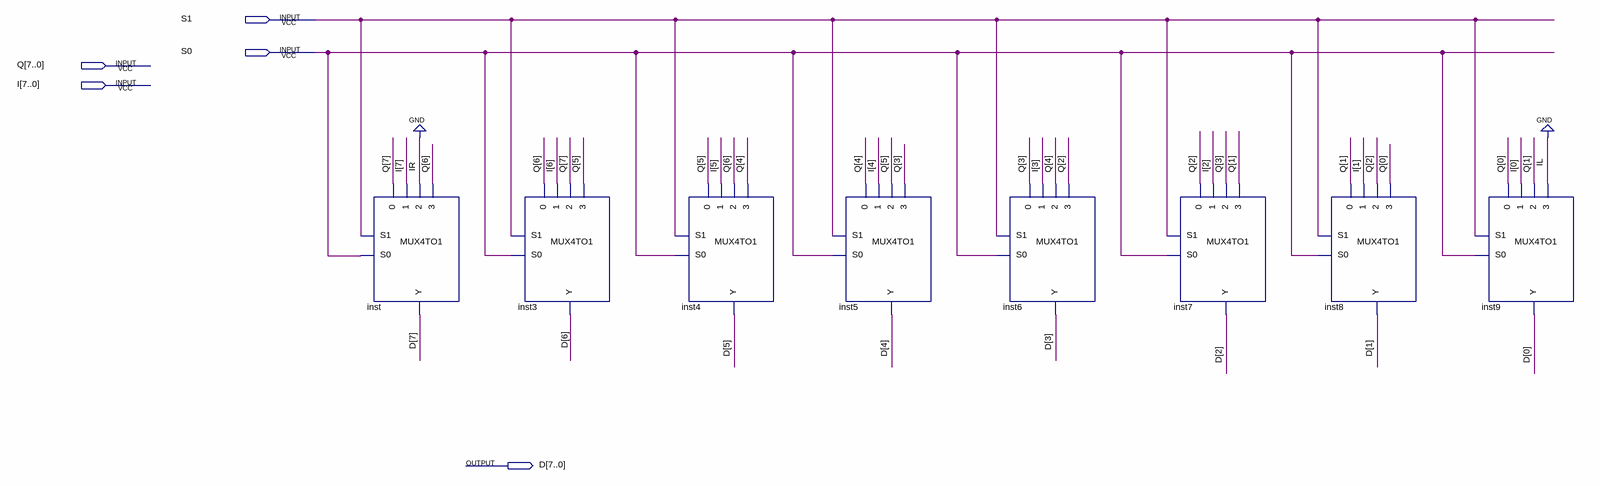
[diagram p0: schematic sheet]
// Quartus schematic SRwPL.bdf as structural Verilog: 8 symbols, 5 pins
module SRwPL (
  input  S1,
  input  S0,
  input  [7:0] Q,
  input  [7:0] I,
  output [7:0] D
);

  MUX4TO1 inst (.S1(S1), .S0(S0), .\0 (Q[7]), .\1 (I[7]), .\2 (1'b0), .\3 (Q[6]), .Y(D[7]));
  MUX4TO1 inst3 (.S1(S1), .S0(S0), .\0 (Q[6]), .\1 (I[6]), .\2 (Q[7]), .\3 (Q[5]), .Y(D[6]));
  MUX4TO1 inst4 (.S1(S1), .S0(S0), .\0 (Q[5]), .\1 (I[5]), .\2 (Q[6]), .\3 (Q[4]), .Y(D[5]));
  MUX4TO1 inst5 (.S1(S1), .S0(S0), .\0 (Q[4]), .\1 (I[4]), .\2 (Q[5]), .\3 (Q[3]), .Y(D[4]));
  MUX4TO1 inst6 (.S1(S1), .S0(S0), .\0 (Q[3]), .\1 (I[3]), .\2 (Q[4]), .\3 (Q[2]), .Y(D[3]));
  MUX4TO1 inst7 (.S1(S1), .S0(S0), .\0 (Q[2]), .\1 (I[2]), .\2 (Q[3]), .\3 (Q[1]), .Y(D[2]));
  MUX4TO1 inst8 (.S1(S1), .S0(S0), .\0 (Q[1]), .\1 (I[1]), .\2 (Q[2]), .\3 (Q[0]), .Y(D[1]));
  MUX4TO1 inst9 (.S1(S1), .S0(S0), .\0 (Q[0]), .\1 (I[0]), .\2 (Q[1]), .\3 (1'b0), .Y(D[0]));
endmodule
